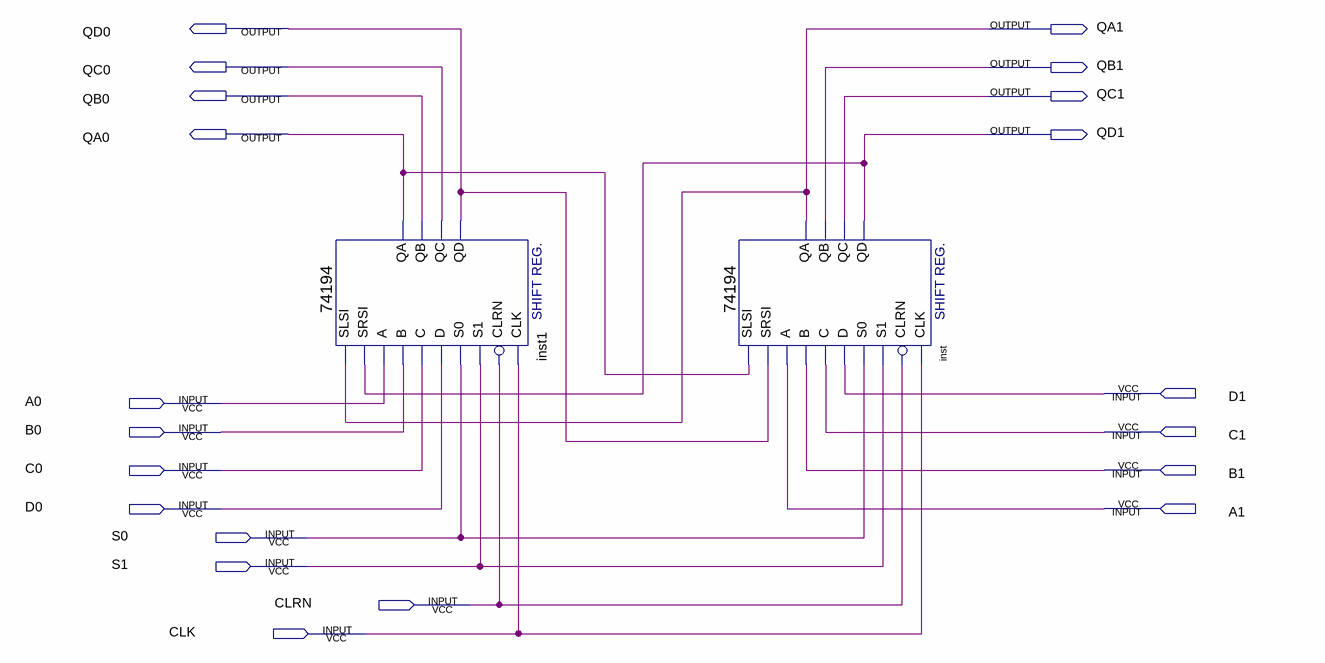
[diagram p0: schematic sheet]
// Quartus schematic bwsxywjcq.bdf as structural Verilog: 2 symbols, 20 pins
module bwsxywjcq (
  input  D1,
  input  A0,
  input  B0,
  input  C1,
  input  C0,
  input  B1,
  input  D0,
  input  A1,
  input  S0,
  input  S1,
  input  CLRN,
  input  CLK,
  output QD0,
  output QA1,
  output QC0,
  output QB1,
  output QB0,
  output QC1,
  output QA0,
  output QD1
);

  \74194  inst1 (
    .SLSI(QA1), .SRSI(QD1), .B(B0), .C(C0), .CLK(CLK), .CLRN(CLRN), .D(D0), .S1(S1), .S0(S0), .A(A0),
    .QA(QA0), .QB(QB0), .QC(QC0), .QD(QD0));
  \74194  inst (
    .SLSI(QA0), .SRSI(QD0), .B(B1), .C(C1), .CLK(CLK), .CLRN(CLRN), .D(D1), .S1(S1), .S0(S0), .A(A1),
    .QA(QA1), .QB(QB1), .QC(QC1), .QD(QD1));
endmodule
